# Altium schematic sheet GENERAL_DIAGRAMS.SchDoc
size A4; SheetNumber: 1; SheetTotal: 3
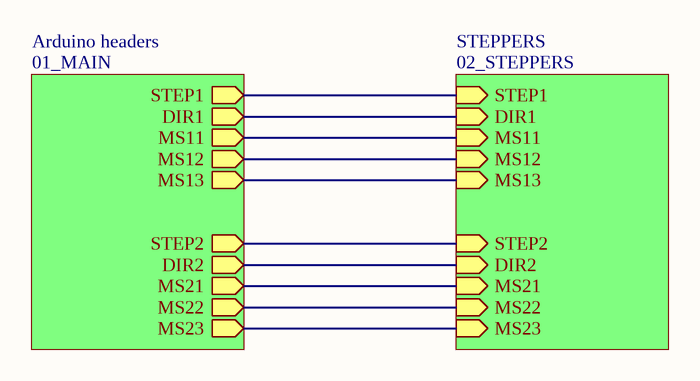
[diagram p0: GENERAL_DIAGRAMS.SchDoc]

## Sub-sheets
Arduino headers = 01_MAIN: STEP1 (out), DIR1 (out), MS11 (out), MS12 (out), MS13 (out), STEP2 (out), DIR2 (out), MS21 (out), MS22 (out), MS23 (out)
STEPPERS = 02_STEPPERS: STEP1 (in), DIR1 (in), MS11 (in), MS12 (in), MS13 (in), STEP2 (in), DIR2 (in), MS21 (in), MS22 (in), MS23 (in)

## Nets
(unnamed): sheet Arduino headers/STEP1, sheet STEPPERS/STEP1
(unnamed): sheet Arduino headers/DIR1, sheet STEPPERS/DIR1
(unnamed): sheet Arduino headers/MS11, sheet STEPPERS/MS11
(unnamed): sheet Arduino headers/MS12, sheet STEPPERS/MS12
(unnamed): sheet Arduino headers/MS13, sheet STEPPERS/MS13
(unnamed): sheet Arduino headers/STEP2, sheet STEPPERS/STEP2
(unnamed): sheet Arduino headers/DIR2, sheet STEPPERS/DIR2
(unnamed): sheet Arduino headers/MS21, sheet STEPPERS/MS21
(unnamed): sheet Arduino headers/MS22, sheet STEPPERS/MS22
(unnamed): sheet Arduino headers/MS23, sheet STEPPERS/MS23